# EAGLE design GBC USB-C Charging Kit Pro (EAGLE 6.2)
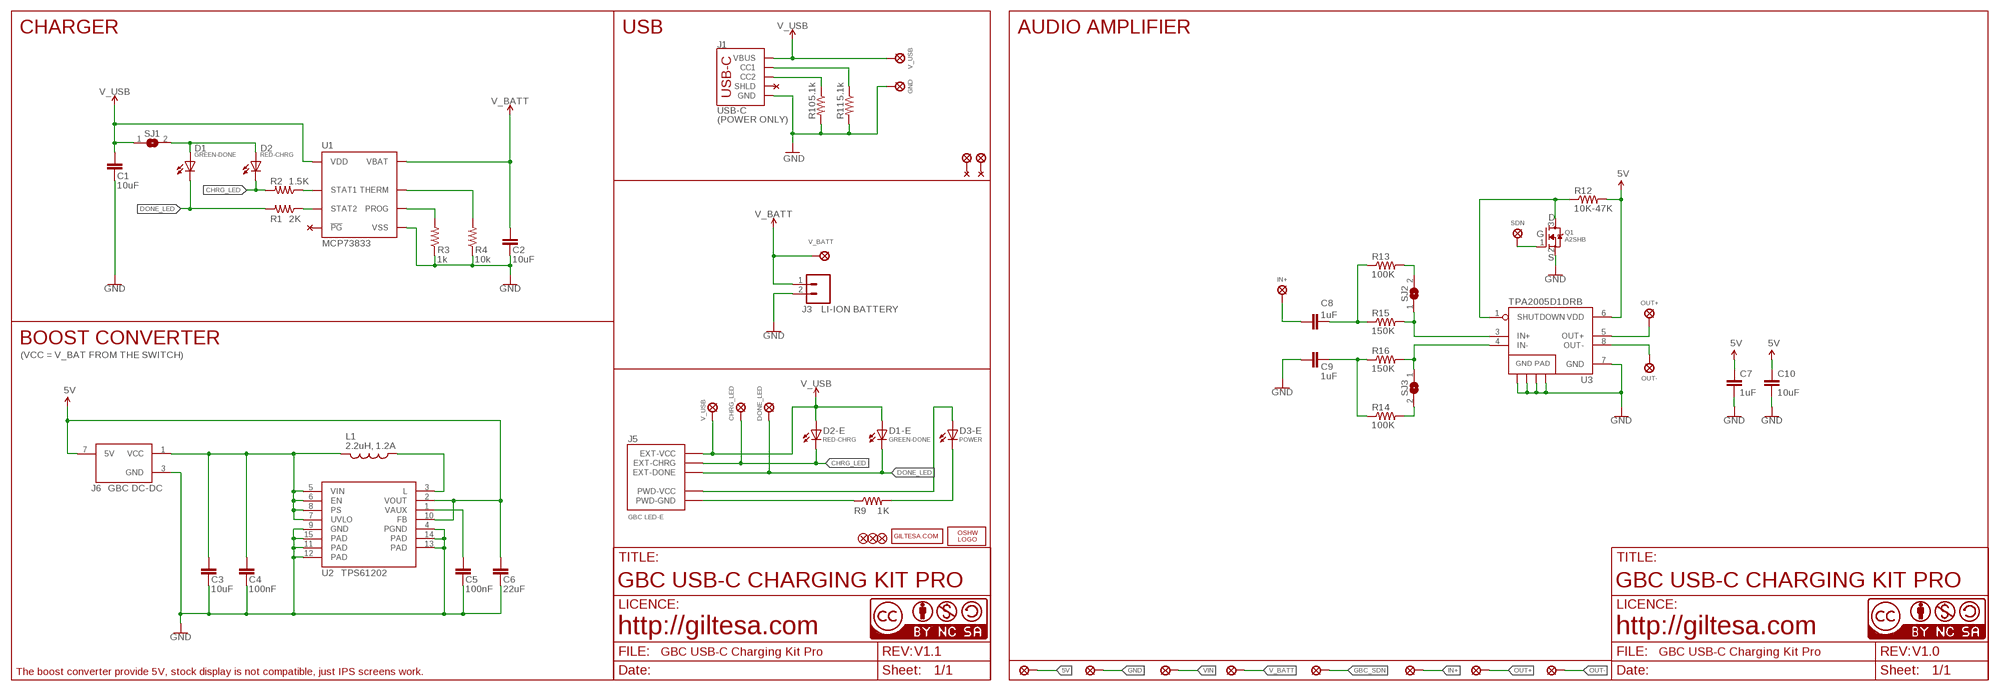
[diagram p0: schematic, sheet 1]

## Parts
C1  10uF  C0603  [C0603]
C2  10uF  C0603  [C0603]
C3  10uF  C1206  [C1206]
C4  100nF  C0603  [C0603]
C5  100nF  C0603  [C0603]
C6  22uF  C0805_SMALL  [C0805_S]
C7  1uF  C1206  [C1206]
C8  1uF  C0402  [C0402]
C9  1uF  C0402  [C0402]
C10  10uF  C1206  [C1206]
D1  GREEN-DONE  L0402  [L0402]
D1-E  GREEN-DONE  L0402  [L0402]
D2  RED-CHRG  L0402  [L0402]
D2-E  RED-CHRG  L0402  [L0402]
D3-E  POWER  L0402  [L0402]
FD2  FIDUCIALUFIDUCIAL  [FIDUCIAL-MICRO]
FD3  FIDUCIALUFIDUCIAL  [FIDUCIAL-MICRO]
FD4  FIDUCIALUFIDUCIAL  [FIDUCIAL-MICRO]
J1  USB-C  USB-CPOWER  [USB-C_6P]
J3  LI-ION BATTERY  JST-21MM  [JST-2-1MM-SMD_RIGHT]
J5  GBC LED-E  GBC_LED  [GBC_LED]
J6  GBC DC-DC  GBC_DC_DCDIP  [GBC_DC_DC_DIP]
L1  2.2uH, 1.2A  INDUCTOR.  [CDRH2D09]
LOGO2  OSHW_LOGO_FILLX0150-NT  [OSHW_FILLX150_NOTEXT]
PP1  SOLDER_PAD-1.5  [SOLDER_PAD_1.5]
PP2  SOLDER_PAD-1.5  [SOLDER_PAD_1.5]
PP3  SOLDER_PAD-1.5  [SOLDER_PAD_1.5]
PP4  SOLDER_PAD-1.5  [SOLDER_PAD_1.5]
PP5  SOLDER_PAD-1.5  [SOLDER_PAD_1.5]
PP6  SOLDER_PAD-1.5  [SOLDER_PAD_1.5]
PP7  SOLDER_PAD-1.5  [SOLDER_PAD_1.5]
PP8  SOLDER_PAD-1.5  [SOLDER_PAD_1.5]
Q1  A2SHB  MOSFET-NREFLOW  [SOT23]
R1  2K  R0402  [R0402]
R2  1.5K  R0402  [R0402]
R3  1k  R0402  [R0402]
R4  10k  R0402  [R0402]
R9  1K  R0402  [R0402]
R10  5.1k  R0402  [R0402]
R11  5.1k  R0402  [R0402]
R12  10K-47K  R0402  [R0402]
R13  100K  R0402  [R0402]
R14  100K  R0402  [R0402]
R15  150K  R0402  [R0402]
R16  150K  R0402  [R0402]
SJ1  JUMPER-SMD0402  [JUMPER-SMD_0402]
SJ2  JUMPER-SMD0402  [JUMPER-SMD_0402]
SJ3  JUMPER-SMD0402  [JUMPER-SMD_0402]
U1  MCP73833  [DFN-10]
U2  TPS61202  TPS61200  [QFN-10_PAD]
U3  TPA2005D1DRB  [QFN-8_PAD]
U$1  V_USB  SOLDER_PAD-1.5  [SOLDER_PAD_1.5]
U$2  SDN  PAD_1.0  [PAD_1.0]
U$3  GND  SOLDER_PAD-1.5  [SOLDER_PAD_1.5]
U$6  CC-BY-NC-SA15MM  [CC-BY-NC-SA_15MM]
U$9  SOLDER_PAD-2.5  [SOLDER_PAD_2.5]
U$16  GILTESA.COM_MASK  [GILTESA.COM_MASK]
U$17  CC-NC-BCNIX  [CC-NC-B_NIX]
U$20  OUT+  SOLDER_PAD-2.0  [SOLDER_PAD_2.0]
U$21  CC-NC-BCNIX  [CC-NC-B_NIX]
U$23  OUT-  SOLDER_PAD-2.0  [SOLDER_PAD_2.0]
U$24  CHRG_LED  SOLDER_PAD-1.3  [SOLDER_PAD_1.3]
U$25  DONE_LED  SOLDER_PAD-1.3  [SOLDER_PAD_1.3]
U$26  V_USB  SOLDER_PAD-1.3  [SOLDER_PAD_1.3]
U$29  V_BATT  PAD_1.25  [PAD_1.25]
U$30  IN+  SOLDER_PAD-1.3  [SOLDER_PAD_1.3]
U$32  SOLDER_PAD-2.5  [SOLDER_PAD_2.5]

## Nets
5V: C6.1 C7.1 C10.1 J6.7(5V) PP1.P$1 R12.2 U2.2(VOUT) U2.10(FB) U3.6(VDD)
CHRG_LED: D2-E.C D2.C J5.EXT-CHRG R2.2 U$24.P$1
DONE_LED: D1-E.C D1.C J5.EXT-DONE R1.2 U$25.P$1
GBC_SDN: PP5.P$1 Q1.1(G) U$2.P$1
GND: C1.2 C2.2 C3.2 C4.2 C5.2 C6.2 C7.2 C9.1 C10.2 J1.GND1(GND) J1.GND2(GND) J3.2 J6.3(GND) PP2.P$1 Q1.2(S) R3.1 R4.1 R10.2 R11.2 U1.P$5(VSS) U1.P$11(VSS) U2.4(PGND) U2.9(GND) U2.11(PAD) U2.12(PAD) U2.13(PAD) U2.14(PAD) U2.15(PAD) U3.7(GND) U3.10(GND) U3.11(GND) U3.12(GND) U3.13(GND) U$3.P$1
IN+: C8.1 PP6.P$1 U$30.P$1
IN+AMP: R15.2 SJ2.1 U3.3(IN+)
IN-AMP: R16.2 SJ3.1 U3.4(IN-)
N$1: D1.A D2.A SJ1.2
N$2: R13.2 SJ2.2
N$3: L1.P$1 U2.3(L)
N$4: J1.B5(CC2) R10.1
N$5: R14.2 SJ3.2
N$7: C5.1 U2.1(VAUX)
N$8: J5.PWD-GND R9.1
N$10: D3-E.A J5.PWD-VCC
N$11: D3-E.C R9.2
N$13: J1.A5(CC1) R11.1
N$14: C8.2 R13.1 R15.1
N$15: C9.2 R14.1 R16.1
OUT+: PP7.P$1 U3.5(OUT+) U$20.P$1
OUT-: PP8.P$1 U3.8(OUT-) U$23.P$1
PROG: R3.2 U1.P$6(PROG)
SDN: Q1.3(D) R12.1 U3.1(SHUTDOWN)
STAT1: R2.1 U1.P$3(STAT1)
STAT2: R1.1 U1.P$4(STAT2)
THERM: R4.2 U1.P$8(THERM)
V_BATT: C2.1 J3.1 PP4.P$1 U1.P$9(VBAT) U1.P$10(VBAT) U$29.P$1
V_USB: C1.1 D1-E.A D2-E.A J1.VBUS1(VBUS) J1.VBUS2(VBUS) J5.EXT-VCC SJ1.1 U1.P$1(VDD) U1.P$2(VDD) U$1.P$1 U$26.P$1
VIN: C3.1 C4.1 J6.1(VCC) L1.P$2 PP3.P$1 U2.5(VIN) U2.6(EN) U2.7(UVLO) U2.8(PS)
Unconnected: J1.SHLD1(SHLD) J1.SHLD2(SHLD) J1.SHLD3(SHLD) J1.SHLD4(SHLD) J1.SHLD5(SHLD) J1.SHLD6(SHLD) J1.SHLD7(SHLD) J1.SHLD8(SHLD) U1.P$7(!PG) U$9.P$1 U$32.P$1

## Notes on the sheet
- CHARGER | USB | AUDIO AMPLIFIER
- (POWER ONLY)
- D
- G
- S
- BOOST CONVERTER
- (VCC = V_BAT FROM THE SWITCH)
- GBC USB-C CHARGING KIT PRO | GBC USB-C CHARGING KIT PRO
- http://giltesa.com | http://giltesa.com
- V1.1 | V1.0
- The boost converter provide 5V, stock display is not compatible, just IPS screens work.

## Library data of the parts
C1 C2 C4 C5 = ,giltesa:C0603
C3 C7 C10 = ,giltesa:C1206
C6 = ,giltesa:C0805
C8 C9 = ,giltesa:C0402
D1 D1-E D2 D2-E D3-E = ,giltesa:L0402
FD2-FD4 = SparkFun-Aesthetics:FIDUCIAL: Fiducial Alignment Points Point-of-reference for pick-and-place machines and other optical instruments.
J1 = ,giltesa:USB-C
J3 = ,giltesa:JST-2
J5 = ,giltesa:GBC_LED
J6 = ,giltesa:GBC_DC_DC
L1 = SparkFun:INDUCTOR: Inductors Basic Inductor/Choke - 0603 and 1206. Footprints are not proven and vary greatly between part numbers.
LOGO2 = ohw-logo:OSHW_LOGO_FILL
PP1-PP8 U$1 U$3 U$9 U$20 U$23-U$26 U$30 U$32 = ,giltesa:SOLDER_PAD
Q1 = adafruit:MOSFET-N: N-Channel Mosfet 2N7002E - 60V 260mA SOT23 [Digikey: 2N7002ET1GOSTR-ND] - REEL BSH103 - 30V 850mA SOT23 [Digikey: 568-5013-1-ND]
R1-R4 R9-R16 = ,giltesa:R0402
SJ1-SJ3 = ,giltesa:JUMPER-SMD
U1 = SparkFun-IC-Power:MCP73833; PROD_ID: IC-14369
U2 = SparkFun:TPS61200: DC to DC Booster
U3 = mike-temp:TPA2005D1: 1.4W MONO CLASS-D AUDIO POWER AMPLIFIER The TPA2005D1 is a 1.4-W high efficiency filter-free class-D audio power amplifier in a BGA, QFN, or MSOP package that requires only three external components. Datasheet: http://focus.ti.com/lit/ds/symlink/tpa2005d1.pdf 1.4 W Into 8 ? From a 5V Supply at THD = 10% (Typ) Maximum Battery Life and Minimum Heat Efficiency With an 8-? Speaker: 84% at 400 mW, 79% at 100 mW 2.8-mA Quiescent Current 0.5-mA Shutdown Current Ideal for Wireless or Cellular Handsets and PDAs Capable of Driving an 8-? Speaker (2.5 V ? VDD ? 5.5 V) and a 4-? Speaker (2.5 V ? VDD ? 4.2 V) Only Three External Components Optimized PWM Output Stage Eliminates LC Output Filter Internally Generated 250-kHz Switching Frequency Eliminates Capacitor and Resistor Improved PSRR (-71 dB at 217 Hz) and Wide Supply Voltage (2.5 V to 5.5 V) Eliminates Need for a Voltage Regulator Fully Differential Design Reduces RF Rectification and Eliminates Bypass Capacitor Improved CMRR Eliminates Two Input Coupling Capacitors
U$2 U$29 = ,giltesa:PAD
U$6 = ,giltesa_logos:CC-BY-NC-SA
U$16 = ,giltesa_logos:GILTESA.COM
U$17 U$21 = cc-by-nc-sa:CC-NC-BC: All hardware is licensed under the Creative Commons Attribution-Noncommercial-Share Alike 2.5 Switzerland License. To view a copy of this license, visit http://creativecommons.org/licenses/by-nc-sa/2.5/ch/ or send a letter to Creative Commons, 171 Second Street, Suite 300, San Francisco, California, 94105, USA.

## Net classes
1 power: width 0.61 mm, drill 0.406 mm, clearance 0.203 mm
2 gnd: width 0.305 mm, drill 0.406 mm, clearance 0.203 mm
3 power usb: width 0.508 mm, drill 0.406 mm, clearance 0.203 mm

## Board
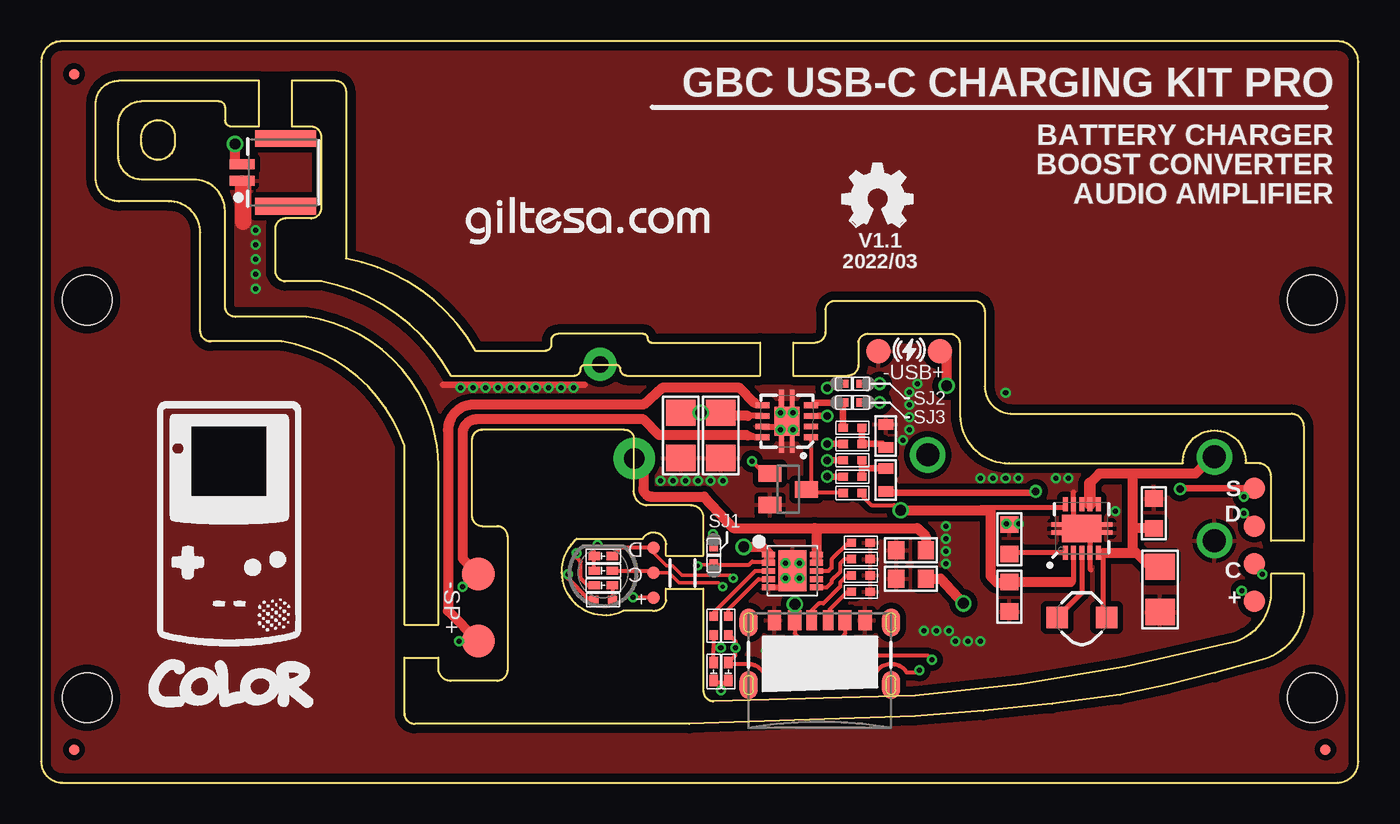
[diagram p1: board, top side]
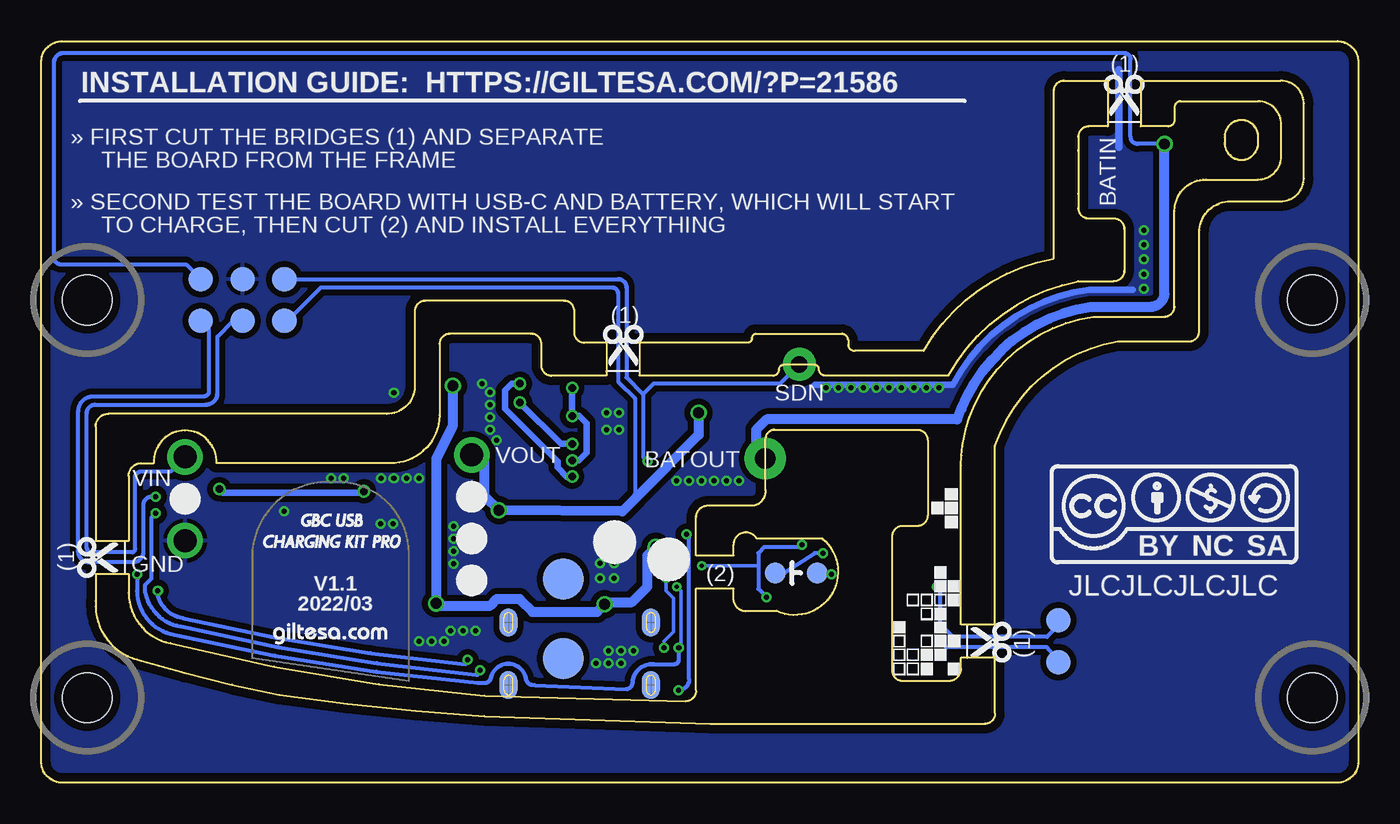
[diagram p2: board, bottom side, seen from below]

Size 79.97 x 45 mm. Coordinates in mm from the lower left corner, seen from the top.
Outline: 17,38.34 17,39.2 arc90 16.37,39.83 15.21,39.83 15.21,42.6 17.87,42.6 arc-90 18.5,41.98 18.5,31.81 arc-50 26.38,26.2 30.59,26.2 arc90 30.97,26.58 30.97,26.85 arc-90 31.38,27.23 36.56,27.23 arc-90 36.81,27 arc90 37.07,26.7 43.65,26.7 43.65,24.7 35.55,24.7 arc-90 35.16,25.1 arc90 34.91,25.35 33.01,25.35 arc90 32.75,25.1 arc-90 32.37,24.7 24.88,24.7 arc50 17,30.43 14.84,30.43 arc-90 14.21,31.07 14.21,33.61 arc-90 14.84,34.24 16.37,34.24 arc90 17,34.88 17,35.74
Outline: 17,38.39 17,35.76
Outline: 40.21,5.57 40.21,11.77 37.93,11.77 37.93,11.09 arc-90 37.13,10.42 35.33,10.42 arc-165 32.53,14.82 36.53,14.82 arc-149 37.93,14.44 37.93,13.77 40.21,13.77 40.21,16.12 arc90 39.44,16.82 36.78,16.82 arc-90 35.98,17.75 35.98,20.91 arc90 35.42,21.42 26.78,21.42 arc90 26.15,20.78 26.15,16.21 arc90 26.78,15.57 27.67,15.57 arc-90 28.31,14.94 28.31,6.81 arc-90 27.67,6.18 24.88,6.18 arc-90 24.11,6.94 24.11,7.59 22.05,7.59 22.05,4.2 arc90 22.69,3.57 39.34,3.57 53.06,4.04 arc5 65.51,5.32 arc5 74.12,7.46 arc80 76.66,11.01 76.66,12.67 74.66,12.67 74.66,11.51 arc-80 72.12,8.46 arc-10 53.06,5.29 40.84,4.94 arc-90 40.21,5.57
Outline: 50.25,27.24 55.15,27.24 arc-90 55.79,26.61 55.79,22.3 arc90 58.76,19.38 69.33,19.38 arc-185 73.14,19.38 73.9,19.38 arc-90 74.66,18.62 74.66,14.67 76.66,14.67 76.66,21.62 arc90 75.9,22.38 58.99,22.38 arc-90 57.29,24.03 57.29,28.61 arc90 56.65,29.24 48.25,29.24 arc90 47.62,28.7 47.62,27.34 arc-90 46.98,26.7 45.65,26.7 45.65,24.7 48.98,24.7 arc90 49.62,25.34 49.62,26.7 arc-90 50.25,27.24
Outline: 1.27,0 78.7,0 arc90 79.97,1.27 79.97,43.73 arc90 78.7,45 1.27,45 arc90 0,43.73 0,1.27 arc90 1.27,0
Outline: 23.61,22.18 arc62 16.11,28.27 11.8,28.27 arc-90 11.16,28.91 11.16,34.7 arc90 9.26,36.6 6.08,36.6 arc-90 4.68,38 4.68,39.96 arc-90 6.08,41.35 10.78,41.35 arc-90 11.16,40.97 11.16,40.21 arc90 11.54,39.83 13.21,39.83 13.21,42.6 4.71,42.6 arc90 3.31,41.2 3.31,36.68 arc90 4.71,35.28 7.76,35.28 arc-90 9.66,33.38 9.66,27.41 arc90 10.3,26.77 14.61,26.77 arc-62 22.05,20.43 22.05,9.59 24.11,9.59 24.11,19.26 arc20 23.61,22.18
Outline: 6.08,39.2 arc-180 8.11,39.2 8.11,38.81 arc-180 6.08,38.81 6.08,39.2
Copper layers (1*16): Top 0.035mm / dielectric 1.6mm / Bottom 0.035mm
Design rules: minimum track width 6mil, minimum drill 12mil, track to track 6mil, track to pad 6mil, pad to pad 6mil, via to via 8mil, smd to smd 0mil, copper to edge 20mil, drill to drill 10mil, minimum pad ring 6mil, minimum via ring 6mil, stop-mask expansion 0mil, vias tented up to drill 100mil, thermal gap 10mil
Holes 3 mm at 77.17,29.29 2.8,29.29 2.8,5.16 77.17,5.16
tRestrict: area 74.6,12.4 to 74.7,14.9; area 43.4,24.5 to 45.9,24.6; area 21.8,7.2 to 22,9.7; area 40.1,5.5 to 40.3,8; area 43.4,26.8 to 45.9,26.9; area 24,7.3 to 24.2,9.9; area 76.7,12.4 to 76.9,14.9; area 9.4,17.6 to 13.4,21.4; area 12.9,42.7 to 15.5,42.8; 1 lines
bRestrict: area 74.6,12.4 to 74.7,14.9; area 43.4,24.5 to 45.9,24.6; area 21.8,7.2 to 22,9.7; area 40.1,5.5 to 40.3,8; area 43.4,26.8 to 45.9,26.9; area 24,7.3 to 24.2,9.9; area 76.7,12.4 to 76.9,14.9; 1 lines

### Footprints (pad centres in the part's own frame; a part is rotated, then mirrored left to right if it is on the bottom)
C0603 = smd 1 x 1.1: 1 -0.901,0; 2 0.901,0
C1206 = smd 1.6 x 1.8: 1 -1.362,0; 2 1.387,0
C0805_S = smd 1 x 1.1: 1 -0.901,0; 2 0.901,0
C0402 = smd 0.635 x 0.9: 1 -0.694,0; 2 0.694,0
L0402 = smd 0.7 x 0.5: A -0.55,0; C 0.55,0
FIDUCIAL-MICRO = smd 0.635 x 0.635: 1 0,0
USB-C_6P = smd 0.635 x 1.2: A5 -0.5,-0.017; B5 0.5,-0.017 | smd 0.8 x 1.2: GND1 -2.75,-0.017; GND2 2.75,-0.017; VBUS1 -1.52,-0.017; VBUS2 1.52,-0.017 | smd 1.1 x 1.7: SHLD1 -4.32,-0.15; SHLD2 4.32,-0.15; SHLD5 -4.32,-3.95; SHLD8 4.32,-3.95 | smd 1.1 x 1.7 bottom: SHLD3 -4.32,-0.15; SHLD4 4.32,-0.15; SHLD6 -4.32,-3.95; SHLD7 4.32,-3.95
JST-2-1MM-SMD_RIGHT = smd 0.6 x 1.524: 1 -0.5,-2.017; 2 0.5,-2.017 | smd 1.016 x 3.683: NC1 -2.054,0.635; NC2 2.054,0.635
GBC_LED = smd 0.762 x 0.762: EXT-CHRG -3.048,0; EXT-DONE -3.048,-1.524; EXT-VCC -3.048,1.524 | smd 1.27 x 1.27 bottom: PWD-GND 1.27,0; PWD-VCC -1.27,0
GBC_DC_DC_DIP = drill 1.397 pad 2.159: 1 17.399,7.493; 3 17.399,2.413; 7 0,7.62
CDRH2D09 = smd 1.3 x 1.3: P$1 -1.5,0; P$2 1.5,0
SOLDER_PAD_1.5 = smd 1.5 x 1.5: P$1 0,0
SOT23 = smd 1 x 1.4: 1 -0.95,-1.1; 2 0.95,-1.1; 3 0,1.1
R0402 = smd 0.559 x 0.5: 1 -0.567,0; 2 0.567,0
JUMPER-SMD_0402 = smd 0.635 x 0.5: 1 -0.559,0; 2 0.559,0
DFN-10 = smd 0.8 x 0.35: P$1 -1.45,1; P$2 -1.45,0.5; P$3 -1.45,0; P$4 -1.45,-0.5; P$5 -1.45,-1; P$6 1.45,-1; P$7 1.45,-0.5; P$8 1.45,0; P$9 1.45,0.5; P$10 1.45,1 | smd 1.7 x 2.5: P$11 0,0
QFN-10_PAD = smd 0.297 x 0.85: 1 -1,-1.475; 2 -0.5,-1.475; 3 0,-1.475; 4 0.5,-1.475; 5 1,-1.475; 6 1,1.475; 7 0.5,1.475; 8 0,1.475; 9 -0.5,1.475; 10 -1,1.475 | smd 0.7 x 0.28: 11 -1.5,0.25; 12 -1.5,-0.25; 13 1.5,0.25; 14 1.5,-0.25 | smd 2.4 x 1.65: 15 0,0
QFN-8_PAD = smd 0.35 x 0.85: 1 -0.975,-1.475; 2 -0.325,-1.475; 3 0.325,-1.475; 4 0.975,-1.475; 5 0.975,1.475; 6 0.325,1.475; 7 -0.325,1.475; 8 -0.975,1.475 | smd 1.75 x 1.5: 9 0,0 | smd 1.025 x 0.28: 10 -1.387,-0.325; 11 1.387,-0.325; 12 1.387,0.325; 13 -1.387,0.325
PAD_1.0 = drill 1 pad 2: P$1 0,0
SOLDER_PAD_2.5 = smd 2.5 x 2.5: P$1 0,0
SOLDER_PAD_2.0 = smd 2 x 2: P$1 0,0
SOLDER_PAD_1.3 = smd 1.3 x 1.3: P$1 0,0
PAD_1.25 = drill 1.25 pad 2.5: P$1 0,0

### Placement (x,y rotation side)
C1  52.82,12.38 180 top
C2  52.82,14.1 180 top
C3  67.93,11.74 270 top
C4  67.55,16.34 90 top
C5  58.79,14.76 90 top
C6  58.79,11.28 270 top
C7  38.84,21.09 270 top
C8  51.28,18.38 90 top
C9  51.28,21.04 270 top
C10  41.27,21.09 270 top
D1  41.72,6.75 90 top
D1-E  34.12,13.75 0 top
D2  40.83,6.75 90 top
D2-E  34.12,12.86 0 top
D3-E  34.12,11.97 0 top
FD2  2,43 0 top
FD3  77.97,2 0 top
FD4  2,2 0 top
J1  47.28,9.87 0 top
J3  14.21,37.04 270 top
J5  34.12,12.73 180 top
J6  53.83,12.27 0 top
L1  63.18,10.02 0 top
LOGO2  48.65,33.75 0 top
PP1  65.2,28.02 0 bottom
PP2  67.75,30.56 0 bottom
PP3  67.75,28.02 0 bottom
PP4  70.28,30.56 0 bottom
PP5  65.2,30.56 0 bottom
PP6  70.28,28.02 0 bottom
PP7  18.21,7.32 0 bottom
PP8  18.21,9.86 0 bottom
Q1  45.36,17.8 270 top
R1  41.72,9.53 270 top
R2  40.83,9.53 270 top
R3  49.77,13.57 180 top
R4  49.77,14.56 180 top
R9  34.12,11.08 0 top
R10  49.77,11.59 0 top
R11  49.77,12.58 0 top
R12  49.26,17.58 0 top
R13  49.26,18.57 180 top
R14  49.26,20.55 180 top
R15  49.26,19.56 180 top
R16  49.26,21.54 180 top
SJ1  40.83,13.79 90 top
SJ2  49.26,24.21 0 top
SJ3  49.26,23.07 0 top
U1  45.61,12.85 0 top
U2  63.18,15.43 0 top
U3  45.28,21.93 90 top
U$1  54.58,26.17 180 top
U$2  33.94,25.38 0 top
U$3  50.83,26.17 180 top
U$6  18.74,13.24 0 bottom
U$7  [GAME_BOY_COLOR]  6.52,4.55 0 top
U$8  [SCISSOR]  44.62,25.29 90 bottom
U$9  48.27,12.35 0 bottom
U$10  [TETRIS]  24.05,6.43 0 top
U$13  [SCISSOR]  14.2,40.46 90 bottom
U$14  [SCISSOR]  23.55,8.52 0 bottom
U$15  [SCISSOR]  75.29,13.67 180 bottom
U$16  25.7,32.59 0 top
U$17  31,-5 0 top  (outside the outline)
U$19  [QI]  52.7,26.27 180 top
U$20  26.53,8.59 0 top
U$21  31,-5 0 top  (outside the outline)
U$23  26.53,12.65 0 top
U$24  73.64,13.29 0 top
U$25  73.64,15.57 0 top
U$26  73.64,11 0 top
U$28  [GAME_BOY_COLOR_2]  7.02,8.21 0 top
U$29  36.01,19.67 0 top
U$30  73.64,17.86 0 top
U$32  48.27,7.52 0 bottom
U$33  [GILTESA.COM_MASK_7MM]  65.9,8.34 0 bottom
U$34  [GAME_BOY_COLOR_USB_CHARGING_KIT_PRO]  66.53,14.18 0 bottom

### Tracks (layer width: path | path; a pad name or v marks a point on that pad's centre or on a via)
5V  (via drill 0.66)
  Top 0.254: U2.10 62.16,16.68 | 62.5,12.18 62.5,12.24 62.47,12.27 | R12.2 49.9,17.51 49.9,17.35 50.4,16.84 51.8,16.84 v52.18,16.53
  Top 0.297: U2.2 62.68,12.23 62.47,12.27
  Top 0.305: 62.16,16.68 57.04,16.68 57.58,16.53
  Top 0.356: U3.6 42.91,22.26
  Top 0.61: 42.91,22.26 41.27,22.26 C10.1 v40.05,22.45 C7.1 | 62.5,12.18 C6.1 58.75,12.14 58.02,12.14 57.64,12.53 57.64,16.46 57.58,16.53 v52.18,16.53
  Bottom 0.254: PP1.P$1 65.01,28.02 62.98,30.05 45.32,30.05 arc90 44.94,29.67 44.94,24.34 43.93,23.32 43.93,17.48 43.8,17.35
  Bottom 0.61: v40.05,22.45 40.05,21.1 43.8,17.35 44.69,16.46 v52.18,16.53 53.07,17.42 53.07,19.77 53.2,19.89 J6.7
CHRG_LED  (via drill 0.25, 0.3)
  Top 0.203: v41.39,11.89 41.13,12.14 38.72,12.14 38.13,12.73 J5.EXT-CHRG 37.24,12.73
  Top 0.254: R2.2 40.83,8.16 | D2.C 40.83,8.16 | 40.83,8.16 41.23,8.16 v41.26,8.18 | D2-E.C 37.04,12.86 J5.EXT-CHRG | U$24.P$1 v74.15,12.65
  Bottom 0.203: v41.39,11.89 41.13,11.64 41.13,8.72 41.13,8.31 v41.26,8.18
  Bottom 0.254: v74.15,12.65 74.15,11.64 arc-80 71.87,8.97 arc-8 53.45,6.05 53.07,6.05 arc-80 52.69,6.3 arc160 50.53,6.3 arc-80 50.15,5.92 50.02,5.92 44.44,5.67 arc-85 44.05,6.18 arc87 42.78,7.19 41.51,7.19 arc-90 41.26,7.45 v41.26,8.18
DONE_LED  (via drill 0.25, 0.3)
  Top 0.203: R1.2 41.78,8.96 | v42.02,12.4 41.84,12.58 38.92,12.58 38.34,13.16 37.96,13.16 37.17,13.95 J5.EXT-DONE
  Top 0.254: 41.78,8.96 42.15,8.59 v42.15,8.18 42.15,7.73 D1.C 41.83,7.19 42.78,7.19 arc-88 44.05,6.18 arc90 44.44,5.67 46.72,5.77 50.02,5.92 arc90 50.53,6.3 arc-138 52.56,6.68 53.2,6.68 v53.33,6.81 | J5.EXT-DONE 35.18,14.26 D1-E.C | 73.64,15.45 U$25.P$1 73.64,15.7 v73.01,16.34
  Bottom 0.203: v42.15,8.18 42.15,8.59 41.58,9.16 41.58,11.19 42.02,11.64 v42.02,12.4
  Bottom 0.254: v53.33,6.81 53.33,6.68 53.45,6.56 53.58,6.56 arc8 71.49,9.48 arc70 73.64,11.51 73.64,12.02 73.26,12.4 73.26,16.08 v73.01,16.34
GBC_SDN  (via drill 0.3)
  Top 0.254: Q1.1 43.92,18.75 v43.16,19.51
  Bottom 0.254: U$2.P$1 35.11,24.21 42.78,24.21 43.42,23.57 | PP5.P$1 44.94,30.56 arc90 44.44,30.05 44.44,24.59 43.42,23.57 | 43.42,23.57 43.42,19.77 v43.16,19.51
GND  (via drill 0.3)
  Top 0.254: v44.89,22.44 44.89,23.27 U3.12 | U3.13 44.95,21.37 v44.89,21.43
  Top 0.297: 62.68,17.65 U2.9 62.68,15.93 U2.15 | U2.14 63.43,15.18 U2.15 | U2.12 62.93,15.18 U2.15 | U2.15 63.68,14.93 U2.4 63.68,12.97 63.74,12.91
  Top 0.356: U1.P$5 45.02,11.85 v45.18,12.39 | U3.7 44.71,21.61 v44.89,21.43
  Top 0.406: 24.39,24.13 32.98,24.13
  Top 0.61: U1.P$11 v45.18,12.39
  Top 1.016: 12.25,34.04 12.25,36.22
  Bottom 0.406: 32.98,24.13 24.62,24.13 arc55 16.32,29.92 13.7,29.92
  Bottom 0.457: 14.54,43.26 14.54,38.56
  other vias: 46.04,12.39 46.04,13.31 45.18,13.31 25.46,23.96 26.22,23.96 26.99,23.96 27.75,23.96 28.51,23.96 29.27,23.96 30.03,23.96 30.8,23.96 31.56,23.96 32.32,23.96 13.02,33.53 13.02,32.64 13.02,31.75 13.02,30.86 13.02,29.98 45.66,21.43 45.66,22.44 44,8 44.77,8 45.53,8 58.56,23.65 65.22,16.47 57.03,18.49 57.8,18.49 58.56,18.49 59.32,18.49 61.61,18.49 62.37,18.49 52.7,23.69 52.7,22.93 37.59,18.33 38.35,18.33 39.11,18.33 39.88,18.33 40.64,18.33 41.4,18.33 52.7,22.17 52.7,21.41 53.21,24.2 52.32,20.77 53.59,9.21 54.35,9.21 55.12,9.21 55.5,8.58 56.26,8.58 57.02,8.58 44.77,7.24 45.53,7.24 46.29,7.24 54.94,15.56 54.94,14.8 54.94,14.04 54.94,13.28 58.61,15.71 59.37,15.71
  pour Top (isolate 0.356): -2,47 81.97,47 81.97,-2 -2,-2
  pour Bottom (isolate 0.356): -2,47 81.97,47 81.97,-2 -2,-2
IN+  (via drill 0.3, 0.46)
  Top 0.254: U$30.P$1 73.52,17.86 v73.01,17.35
  Top 0.406: C8.1 51.34,17.68 51.42,17.61 60.31,17.61 v60.39,17.68 | 73.64,17.99 U$30.P$1 69.2,17.86 v69.15,17.81
  Bottom 0.254: v73.01,17.35 73.26,17.35 arc-90 73.77,16.84 73.77,14 arc90 74.41,13.37 77.07,13.37 arc90 77.71,14 77.71,22.56 arc90 76.82,23.45 70.09,23.45 arc-90 69.78,23.76 69.78,27.51 PP6.P$1
  Bottom 0.406: 69.02,17.68 v69.15,17.81 68.95,17.61 60.44,17.61 60.39,17.66 v60.39,17.68
IN+AMP  (via drill 0.46)
  Top 0.305: U3.3 47.21,22.26
  Top 0.406: R15.2 v47.74,19.56 | 47.21,22.26 v47.74,22.26 | SJ2.1 47.99,24.21 v47.74,23.96
  Bottom 0.406: v47.74,23.96 v47.74,22.26 47.31,22.26 46.85,21.8 46.85,20.02 47.3,19.56 v47.74,19.56
IN-AMP
  Top 0.305: U3.4 46.88,22.97
  Top 0.356: 46.88,22.97 46.98,23.07
  Top 0.381: R16.2 48.69,22.95 SJ3.1 46.98,23.07
N$1  (via drill 0.3)
  Top 0.254: 41.28,6.07 v41.28,5.61 | SJ1.2 40.83,15.01 v40.8,15.07 | 41.28,6.07 41.72,6.07 D1.A | 41.28,6.07 40.83,6.07 D2.A
  Bottom 0.254: v41.28,5.61 arc-90 40.62,6.27 40.62,14.91 v40.8,15.07
N$2  (via drill 0.46)
  Top 0.406: SJ2.2 v50.91,24.21 | R13.2 v47.74,18.57
  Bottom 0.406: v47.74,18.57 48.07,18.57 48.63,19.13 48.63,19.51 51.8,22.69 51.8,23.83 51.42,24.21 v50.91,24.21
N$3
  Top 0.297: U2.3 63.18,11.52 L1.P$1
N$4
  Top 0.254: R10.1 48.96,11.59 47.86,10.49 47.86,9.94 J1.B5
N$5  (via drill 0.46)
  Top 0.406: SJ3.2 v50.91,23.07 | R14.2 v47.74,20.55
  Bottom 0.406: v47.74,20.55 48.4,20.55 v50.91,23.07
N$7
  Top 0.254: U2.1 62.06,13.95
  Top 0.305: C5.1 58.83,13.95 62.06,13.95
N$8  (via drill 0.3)
  Top 0.254: R9.1 33.31,11.08 31.99,12.4 v31.99,12.65
  Bottom 0.254: J5.PWD-GND 32.07,12.73 v31.99,12.65
N$10  (via drill 0.3)
  Top 0.254: D3-E.A 33.18,11.97 32.75,12.4 32.75,13.41 32.5,13.67 v32.5,13.92
  Bottom 0.254: v32.5,13.92 33.01,13.92 34.83,12.73 J5.PWD-VCC
N$11
  Top 0.254: D3-E.C 34.69,11.97 R9.2
N$13
  Top 0.254: R11.1 48.93,12.58 48.5,12.14 48.5,11.89 47.48,10.88 47.23,10.88 46.72,10.37 46.78,10.31 J1.A5
N$14
  Top 0.406: R15.1 R13.1 49.83,19.07 C8.2
N$15
  Top 0.406: R16.1 R14.1 51.08,20.55 C9.2
OUT+  (via drill 0.3)
  Top 0.254: v25.38,8.59 U$20.P$1
  Top 0.356: U3.5 43.32,22.91 43.29,23.07
  Top 0.61: 43.29,23.07 42.4,23.96 37.7,23.96 36.56,22.94 26.27,22.94 arc90 24.7,21.42 24.7,10.42 U$20.P$1
  Bottom 0.254: PP7.P$1 18.21,7.39 18.91,8.21 25,8.21 v25.38,8.59
OUT-  (via drill 0.3)
  Top 0.254: v25.57,11.89 26.4,12.65 U$23.P$1
  Top 0.356: U3.8 42.86,20.96 | 42.86,20.96 42.78,21.04 42.84,21.21 43.34,20.96 42.92,20.96 42.8,21.09 | 42.86,20.96 42.86,20.98 42.76,21.09 42.76,21.14
  Top 0.61: 42.8,21.09 37.53,21.09 36.56,22.05 26.4,22.05 arc90 25.59,21.16 25.59,13.6 U$23.P$1
  Bottom 0.254: PP8.P$1 18.21,9.54 18.91,8.84 24.62,8.84 25.38,9.61 25.38,11.64 v25.57,11.89
PROG
  Top 0.254: R3.2 48.78,13.57 48.5,13.29 48.5,12.78 47.99,12.27 47.99,12.14 47.7,11.85 U1.P$6
SDN
  Top 0.254: R12.1 46.68,17.58 Q1.3 46.75,18.1 U3.1
STAT1
  Top 0.254: R2.1 40.83,10.32 43.36,12.85 U1.P$3
STAT2
  Top 0.254: R1.1 41.72,10.51 43.56,12.35 U1.P$4
THERM
  Top 0.254: R4.2 49.01,14.56 47.99,13.54 47.99,13.03 47.81,12.85 U1.P$8
V_BATT  (via drill 0.66)
  Top 0.254: U1.P$9 U1.P$10 47.06,13.88 47.1,13.92
  Top 0.61: 46.98,15.45 42.02,15.45 40.24,17.35 37.07,17.35 arc-90 36.56,17.86 36.56,19.12 U$29.P$1 | 46.98,15.45 53.2,15.45 53.71,14.94 C2.1 | 46.98,15.45 47.1,15.32 47.1,13.92 47.1,13.54 | J3.1 11.73,37.54 11.77,37.6 v11.77,38.76
  Bottom 0.254: v11.77,38.76 13.39,38.76 arc90 13.83,39.2 13.83,43.9 arc-90 14.21,44.28 78.62,44.28 arc-90 79.2,43.7 79.2,31.9 arc-90 78.75,31.45 71.17,31.45 PP4.P$1
  Bottom 0.61: v11.77,38.76 11.77,29.67 arc90 12.68,28.88 16.24,28.88 arc-60 24.09,22.69 24.11,22.69 24.37,22.05 35.93,22.05 36.56,21.42 36.56,20.23 U$29.P$1
V_USB  (via drill 0.25, 0.3, 0.66)
  Top 0.203: SJ1.1 39.94,13.23 v39.86,13.16
  Top 0.254: 44.18,13.92 44.16,13.91 U1.P$1 U1.P$2 44.1,13.41 43.16,13.41 42.98,13.23 SJ1.1 | v33.77,14.43 33.57,14.24 D1-E.A D2-E.A | J5.EXT-VCC 35.97,11.21 v35.93,11.26 | U$26.P$1 v72.88,11.64 | J1.VBUS1 45.76,9.04 46.09,8.72 48.5,8.72 | J1.VBUS2 48.8,9.01 48.5,8.72 | v54.09,7.45 53.83,7.7 49.52,7.7 48.5,8.72
  Top 0.61: J1.VBUS1 v45.76,10.82 | v42.66,14.3 43.8,14.3 44.18,13.92 44.18,13.54 | U$1.P$1 54.98,26.17 v54.98,24.08 | C1.1 54.62,12.38 v55.99,10.88
  Bottom 0.203: v39.86,13.16 36.43,13.16
  Bottom 0.254: v35.93,11.26 36.43,11.76 36.43,13.16 36.43,13.92 36.05,14.3 33.89,14.3 v33.77,14.43 | v72.88,11.64 72.88,11.38 arc-70 71.36,9.99 arc-8 54.21,7.19 54.09,7.32 v54.09,7.45
  Bottom 0.61: v42.66,14.3 43.16,13.8 43.16,11.89 44.11,10.95 45.58,10.95 45.7,10.82 v45.76,10.82 46.21,10.37 50.15,10.37 50.91,11.13 52.31,11.13 52.69,10.75 55.86,10.75 | v55.99,10.88 55.99,19.64 54.98,21.67 v54.98,24.08 | v55.99,10.88 55.99,10.75 55.86,10.75 | 55.86,10.75 v55.99,10.88
VIN
  Top 0.254: U2.8 U2.7 U2.6 | U2.5 64.47,13.95
  Top 0.297: 64.47,13.95 64.47,10.22 L1.P$2
  Top 0.61: J6.1 71.1,19.77 70.09,18.75 66.41,18.75 | 66.41,18.75 64.25,18.75 63.68,18.18 | C3.1 67.35,13.1 66.5,13.95 | 66.5,13.95 66.28,14.18 66.28,15.32 | 66.28,15.32 66.28,18.5 66.41,18.75 | C4.1 66.39,15.43 66.28,15.32 | 64.47,13.95 66.5,13.95
  Top 0.711: U2.7 63.68,18.18
  Bottom 0.254: J6.1 72.12,18.88 73.9,18.88 arc-90 74.28,18.5 74.28,14.23 arc90 74.43,13.98 76.85,13.98 arc90 77.2,14.23 77.2,22.43 arc90 76.69,22.94 69.96,22.94 arc-90 69.27,23.63 69.27,27.06 68.31,28.02 PP3.P$1

### Text on the board
tPlace: GBC USB-C CHARGING KIT PRO | BATTERY CHARGER | BOOST CONVERTER | AUDIO AMPLIFIER | V1.1 | 2022/03 | -USB+ | S | D | D | C | C | -SP+ | + | +
bPlace: (1) | INSTALLATION GUIDE: HTTPS://GILTESA.COM/?P=21586 | » FIRST CUT THE BRIDGES (1) AND SEPARATE | THE BOARD FROM THE FRAME | BATIN | » SECOND TEST THE BOARD WITH USB-C AND BATTERY, WHICH WILL START | TO CHARGE, THEN CUT (2) AND INSTALL EVERYTHING | (1) | SDN | BATOUT | VOUT | VIN | (1) | (2) | GND | JLCJLCJLCJLC | V1.1 | 2022/03 | (1)
Measures: 0.0562248995983936
tDocu: U3 | U2